# EAGLE design Optokoppleradapter_Spannungsmessung_V1_1 (EAGLE 6.1)
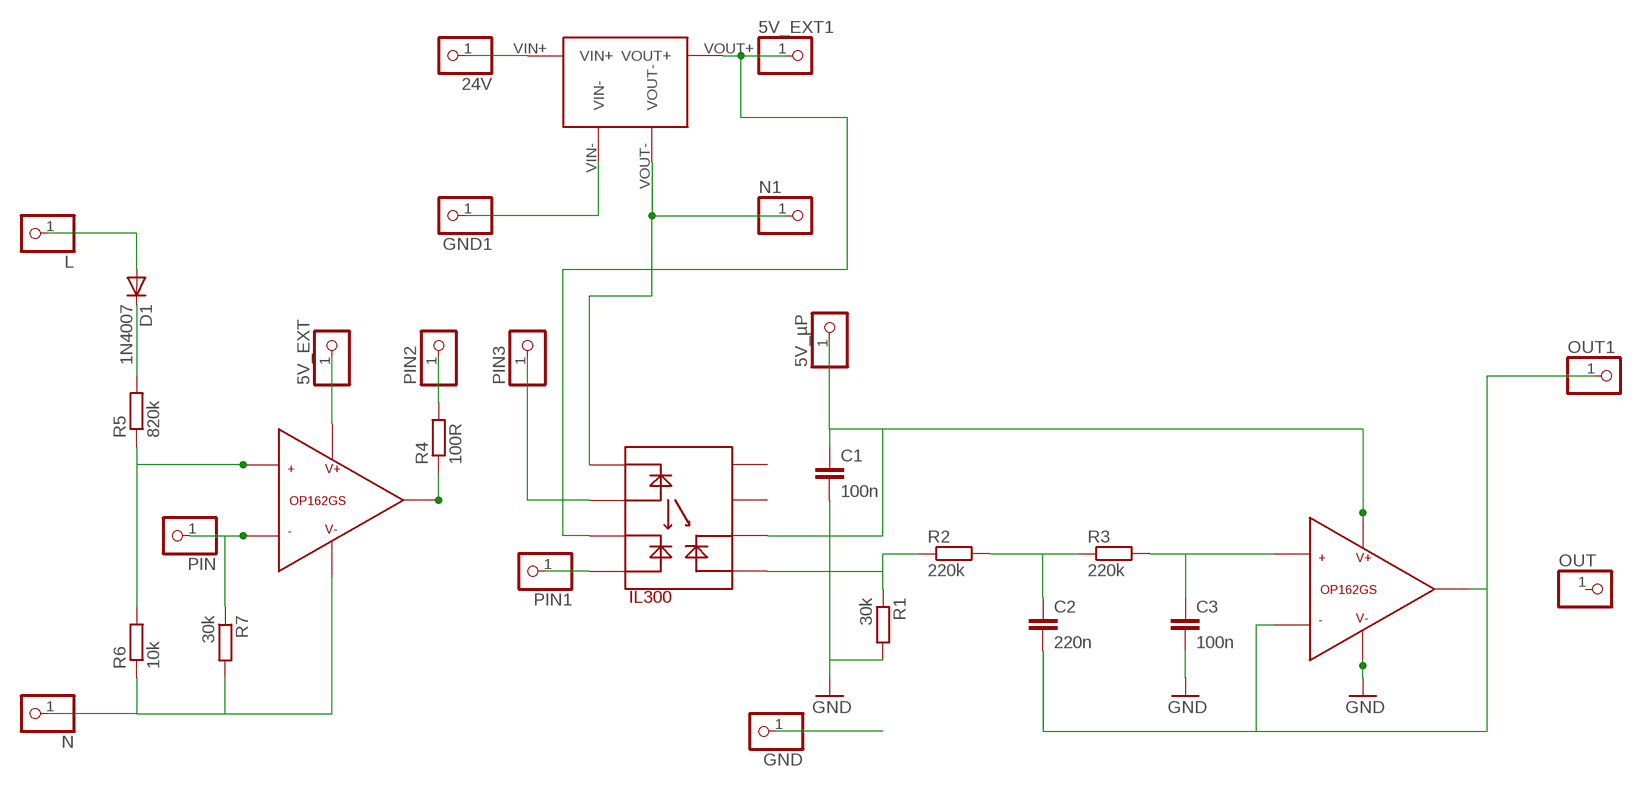
[diagram p0: schematic, sheet 1]

## Parts
5V_EXT  PINHD-1X1  [1X01]
5V_EXT1  PINHD-1X1  [1X01]
5V_µP  PINHD-1X1  [1X01]
24V  PINHD-1X1  [1X01]
C1  100n  C-EUC0805  [C0805]
C2  220n  C-EUC0805  [C0805]
C3  100n  C-EUC0805  [C0805]
D1  1N4007  1N4148DO35-7  [DO35-7]
GND  PINHD-1X1  [1X01]
GND1  PINHD-1X1  [1X01]
L  PINHD-1X1  [1X01]
N  PINHD-1X1  [1X01]
N1  PINHD-1X1  [1X01]
OUT  PINHD-1X1  [1X01]
OUT1  PINHD-1X1  [1X01]
PIN  PINHD-1X1  [1X01]
PIN1  PINHD-1X1  [1X01]
PIN2  PINHD-1X1  [1X01]
PIN3  PINHD-1X1  [1X01]
R1  30k  R-EU_R0805  [R0805]
R2  220k  R-EU_R0805  [R0805]
R3  220k  R-EU_R0805  [R0805]
R4  100R  R-EU_R0805  [R0805]
R5  820k  R-EU_0207/7  [0207/7]
R6  10k  R-EU_0207/7  [0207/7]
R7  30k  R-EU_0207/7  [0207/7]
U$1  IL300  [DIP8]
U$2  OP162GS  [SOIC_N]
U$3  OP162GS  [SOIC_N]
U$4  RECOM_RO-2405S  [4PIN_SIP]

## Nets
5V_EXTERN: 5V_EXT.1 U$2.P$7(V+)
5V_EXTERN1: 5V_EXT1.1 U$1.P$3 U$4.VOUT+
5V_µP: 5V_µP.1 C1.1 U$1.P$6 U$3.P$7(V+)
24V: 24V.1 U$4.VIN+
GND: GND.1
GND1: C1.2 C3.2 GND1.1 R1.2 U$3.P$4(V-) U$4.VIN- ; supply symbol labelled GND
L: D1.A L.1
N: N.1 R6.1 R7.2 U$2.P$4(V-)
N1: N1.1 U$1.P$1 U$4.VOUT-
N$1: D1.C R5.2
N$2: R5.1 R6.2 U$2.P$3(+)
N$3: PIN1.1 U$1.P$4
N$4: PIN.1 R7.1 U$2.P$2(-)
N$5: R4.1 U$2.P$6(OUT)
N$6: PIN2.1 R4.2
N$7: PIN3.1 U$1.P$2
N$10: R1.1 R2.1 U$1.P$5
N$11: C2.1 R2.2 R3.1
N$12: C3.1 R3.2 U$3.P$3(+)
OUT1: C2.2 OUT1.1 U$3.P$2(-) U$3.P$6(OUT)
Unconnected: OUT.1 U$1.P$7 U$1.P$8

## Library data of the parts
5V_EXT 5V_EXT1 5V_µP 24V GND GND1 L N N1 OUT OUT1 PIN PIN1-PIN3 = pinhead:PINHD-1X1: PIN HEADER
C1-C3 = resistor:C-EU: CAPACITOR, European symbol
D1 = diode:1N4148: DIODE high speed (Philips)
R1-R7 = resistor:R-EU_: RESISTOR, European symbol
U$1 = ADS:IL300
U$2 U$3 = ADS:OP162GS
U$4 = ADS:RECOM_RO-2405S

## Board
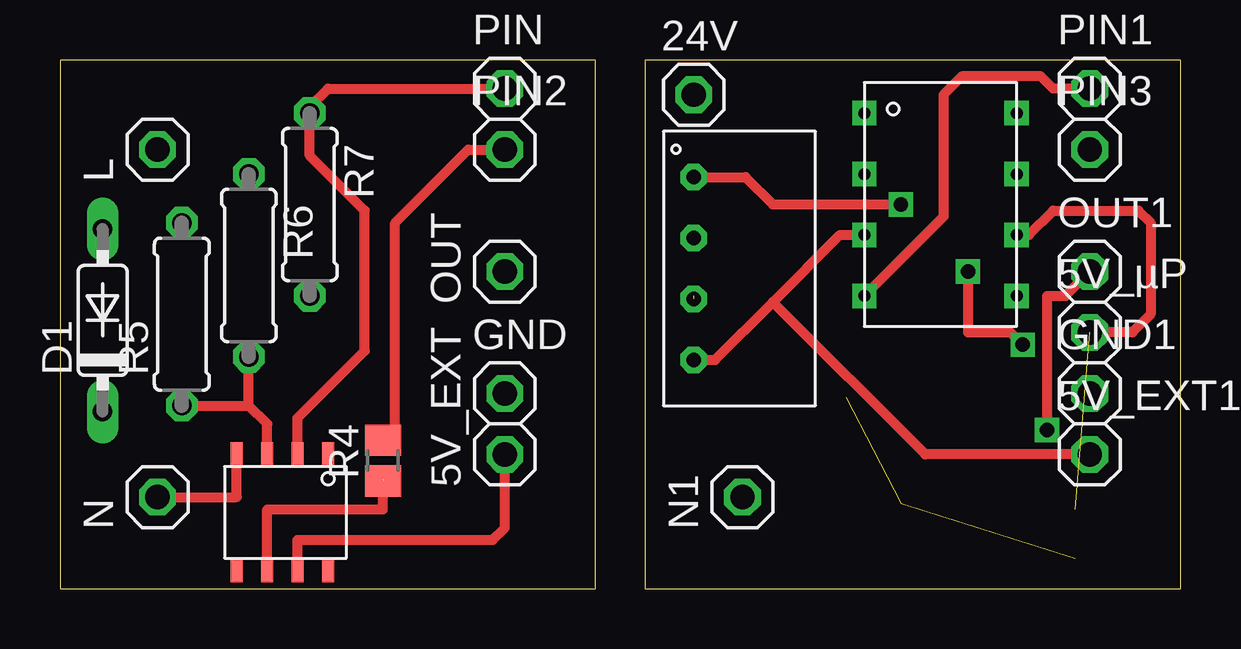
[diagram p1: board, top side]
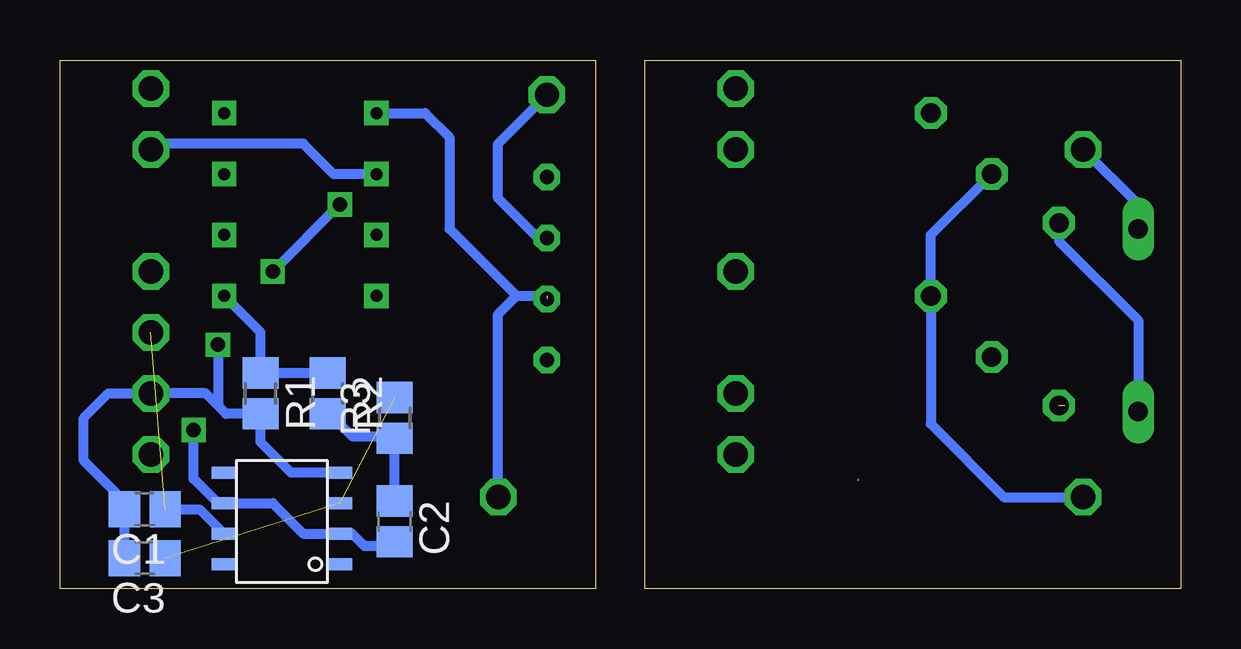
[diagram p2: board, bottom side, seen from below]

Size 46.72 x 22.02 mm. Coordinates in mm from the lower left corner, seen from the top.
Outline: 0,0 22.33,0 22.33,22.02 0,22.02 0,0
Outline: 24.38,0 46.72,0 46.72,22.02 24.38,22.02 24.38,0
Copper layers (1*16): Top 0.035mm / dielectric 1.5mm / Bottom 0.035mm
Design rules: minimum track width 10mil, minimum drill 24mil, track to track 8mil, track to pad 8mil, pad to pad 8mil, via to via 8mil, smd to smd 8mil, copper to edge 40mil, drill to drill 8mil, minimum pad ring 10mil, minimum via ring 8mil, stop-mask expansion 4mil, vias tented up to drill 0mil, thermal gap 10mil

### Footprints (pad centres in the part's own frame; a part is rotated, then mirrored left to right if it is on the bottom)
1X01 = drill 1.016 octagon: 1 0,0
C0805 = smd 1.3 x 1.5: 1 -0.85,0; 2 0.85,0
DO35-7 = drill 0.813 long: A 3.81,0; C -3.81,0
R0805 = smd 1.3 x 1.5: 1 -0.85,0; 2 0.85,0
0207/7 = drill 0.813 octagon: 1 -3.81,0; 2 3.81,0
DIP8 = drill 0.5 square: P$1 0,8.89; P$2 0,6.35; P$3 0,3.81; P$4 0,1.27; P$5 6.35,1.27; P$6 6.35,3.81; P$7 6.35,6.35; P$8 6.35,8.89
SOIC_N = smd 1.016 x 0.508: P$1 -0.508,4.318; P$2 -0.508,3.048; P$3 -0.508,1.778; P$4 -0.508,0.508; P$5 4.318,0.508; P$6 4.318,1.778; P$7 4.318,3.048; P$8 4.318,4.318
4PIN_SIP = drill 0.6 octagon: VIN+ 4.445,1.27; VIN- 1.905,1.27; VOUT+ 9.525,1.27; VOUT- 6.985,1.27

### Placement (x,y rotation side)
5V_EXT  18.54,5.59 90 top
5V_EXT1  42.93,5.59 0 top
5V_µP  42.93,10.67 0 top
24V  26.42,20.57 0 top
C1  43.18,3.3 180 bottom
C2  32.77,2.79 270 bottom
C3  43.18,1.27 180 bottom
D1  1.78,11.18 90 top
GND  18.54,8.13 0 top
GND1  42.93,8.13 0 top
L  4.06,18.29 90 top
N  4.06,3.81 90 top
N1  28.45,3.81 90 top
OUT  18.54,13.21 90 top
OUT1  42.93,13.21 0 top
PIN  18.54,20.83 0 top
PIN1  42.93,20.83 0 top
PIN2  18.54,18.29 0 top
PIN3  42.93,18.29 0 top
R1  38.35,8.13 270 bottom
R2  35.56,8.13 270 bottom
R3  32.77,7.11 90 bottom
R4  13.46,5.33 90 top
R5  5.08,11.43 90 top
R6  7.87,13.46 270 top
R7  10.41,16 270 top
U$1  33.53,10.92 0 top
U$2  6.86,5.08 270 top
U$3  35.56,5.33 180 bottom
U$4  25.15,19.05 270 top

### Tracks (layer width: path | path; a pad name or v marks a point on that pad's centre or on a via)
5V_EXTERN
  Top 0.406: U$2.P$7 9.91,2.03 18.03,2.03 18.54,2.54 5V_EXT.1
5V_EXTERN1
  Top 0.406: U$4.VOUT+ 27.3,9.53 29.72,11.94 | 29.72,11.94 32.51,14.73 U$1.P$3 | 5V_EXT1.1 36.07,5.59 29.72,11.94
5V_µP  (1 unrouted)
  Top 0.406: U$1.P$6 40.39,14.73 41.4,15.75 44.96,15.75 45.47,15.24 45.47,11.43 44.7,10.67 5V_µP.1
  Bottom 0.406: C1.1 40.89,3.3 U$3.P$7
24V
  Bottom 0.406: U$4.VIN+ 26.8,14.61 28.45,16.26 28.45,18.54 24V.1
GND1  (via drill 0.6)
  Top 0.406: U$4.VIN- 28.57,17.14 29.72,16 v35.05,16 | v37.85,13.21 37.85,10.67 39.62,10.67 v40.13,10.16
  Bottom 0.406: U$3.P$4 37.08,4.83 38.35,6.1 R1.2 39.79,7.28 40.13,7.62 | 40.13,7.62 40.64,8.13 GND1.1 44.7,8.13 45.72,7.11 45.72,5.33 44.03,3.64 C1.2 C3.2 | v35.05,16 v37.85,13.21 | v40.13,10.16 40.13,7.62
L
  Bottom 0.406: D1.A 1.78,16 L.1
N
  Top 0.406: N.1 7.37,3.81 U$2.P$4
  Bottom 0.406: N.1 7.37,3.81 10.41,6.86 R7.2 10.41,14.73 R6.1
N1  (1 unrouted)
  Bottom 0.406: N1.1 28.45,11.43 27.69,12.19 | 27.69,12.19 26.42,12.19 | U$1.P$1 31.5,19.81 30.48,18.8 30.48,14.99 27.69,12.19
N$1
  Bottom 0.406: R5.2 5.08,14.48 1.78,11.18 D1.C
N$2  (1 unrouted)
  Top 0.406: U$2.P$3 8.64,6.86 7.87,7.62 | 4.83,7.62 7.87,7.62 | 7.87,7.62 R6.2
N$3
  Top 0.406: PIN1.1 41.4,20.83 40.89,21.34 37.59,21.34 36.83,20.57 36.83,15.49 U$1.P$4
N$4
  Top 0.406: U$2.P$2 9.91,7.11 12.7,9.91 12.7,15.75 10.41,18.03 R7.1 10.41,20.07 11.18,20.83 PIN.1
N$5  (1 unrouted)
  Top 0.406: U$2.P$6 8.64,3.3 13.46,3.3 13.46,4.57
N$6
  Top 0.406: R4.2 13.97,6.18 13.97,15.24 17.02,18.29 PIN2.1
N$7
  Bottom 0.406: U$1.P$2 35.31,17.27 36.58,18.54 42.67,18.54 PIN3.1
N$10
  Bottom 0.406: U$1.P$5 38.35,10.67 R1.1 R2.1
N$11
  Bottom 0.406: C2.1 R3.1 32.85,6.35 34.54,6.35 35.47,7.28 R2.2
N$12  (2 unrouted)
OUT1  (via drill 0.6)
  Top 0.406: v41.15,6.6 41.15,12.19 41.91,12.19 OUT1.1
  Bottom 0.406: v41.15,6.6 41.15,4.57 40.13,3.56 U$3.P$6 37.85,3.56 36.58,2.29 U$3.P$2 34.54,2.29 34.04,1.78 32.93,1.78 C2.2